# Altium schematic sheet Power.SchDoc: param:Title
size A4; Author: param:Autor; Wersja: param:Wersja
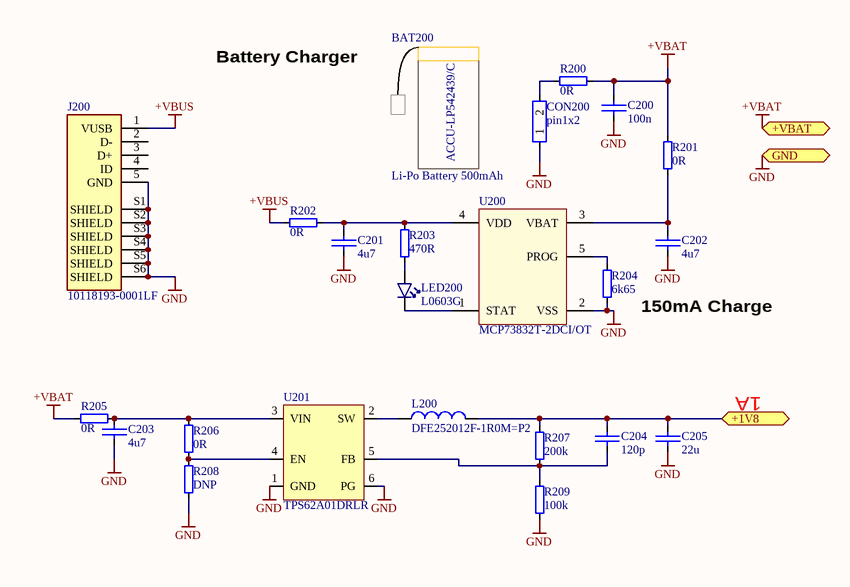
[diagram p0: Power.SchDoc]

## Parts
BAT200  Li-Po Battery 500mAh  [Battery 500maH]
C200  100n  [0402_C]
C201  4u7  [0603_C]
C202  4u7  [0603_C]
C203  4u7  [0603_C]
C204  120p  [0402_C]
C205  22u  [0805_c]
CON200  pin1x2  [piny1x2]
J200  10118193-0001LF  [FCI_10118193-0001LF]
L200  DFE252012F-1R0M=P2  [INDC2520X120N]
LED200  L0603G  [LED_0603_G]
R200  0R  [0603]
R201  0R  [0603]
R202  0R  [0603]
R203  470R  [0603]
R204  6k65  [0603]
R205  0R  [0603]
R206  0R  [0603]
R207  200k  [0603]
R208  DNP  [0603]
R209  100k  [0603]
U200  MCP73832T-2DCI/OT  [SOT95P280X145-5N]
U201  TPS62A01DRLR  [TPS62A01DRLR]

## Ports
+1V8 (bidir), +VBAT (bidir), GND (bidir)

## Nets
+VBAT: C200.2 R200.1 R201.1 R205.2 ; port +VBAT
+VBUS: J200.1(VUSB) R202.2
GND: C200.1 C201.1 C202.1 C203.1 C205.1 CON200.1 J200.5(GND) J200.S1(SHIELD) J200.S2(SHIELD) J200.S3(SHIELD) J200.S4(SHIELD) J200.S5(SHIELD) J200.S6(SHIELD) R204.2 R208.2 R209.2 U200.2(VSS) U201.1(GND) U201.6(PG) ; port GND
+1V8: C204.2 C205.2 L200.2 R207.1 ; port +1V8
NetC201_2: C201.2 R202.1 R203.1 U200.4(VDD)
NetC202_2: C202.2 R201.2 U200.3(VBAT)
NetC203_2: C203.2 R205.1 R206.1 U201.3(VIN)
NetC204_1: C204.1 R207.2 R209.1 U201.5(FB)
NetCON200_2: CON200.2 R200.2
NetL200_1: L200.1 U201.2(SW)
NetLED200_1: LED200.1(C) U200.1(STAT)
NetLED200_2: LED200.2(A) R203.2
NetR204_1: R204.1 U200.5(PROG)
NetR206_2: R206.2 R208.1 U201.4(EN)

Not connected (* = marked no-connect by the designer): J200 2(D-) 3(D+) 4(ID)

## Notes on the sheet
- Battery Charger
- ACCU-LP542439/C
- 150mA Charge
- 1A
- Project:
- Copyright
- ©
- AMC
- Designers:
- Subject:
- Variant:
- Data:
- Version:
- Sheet:
- /

## Library data of the parts
BAT200 = Li-Po Battery 500mAh: ACCU-LP542439/C
C200-C205 = CAP: Capacitor
CON200 = pin1x2: 1x2
J200 = 10118193-0001LF: USB - micro B USB 2.0 Receptacle Connector 5 Position Surface Mount, Right Angle; Through Hole; MF: Amphenol ICC; Availability: Unavailable; SnapEDA_Link: https://www.snapeda.com/parts/10118193-0001LF/Amphenol%20FCI/view-part/2758989/?ref=snap; MP: 10118193-0001LF; Price: None; Value: *; Package: None
L200 = DFE252012F-1R0M=P2: Inductor with Inductance: 1uH Tol. +/-20%, Package: 1008 _2520_; MF: Murata Electronics; MP: DFE252012F-1R0M=P2; Package: 2520 Murata; SnapEDA_Link: https://www.snapeda.com/parts/DFE252012F-1R0M%3DP2/Murata%20Electronics%20North%20America/view-part/1498728/?ref=snap; Digi-Key_Purchase_URL: https://www.digikey.ru/product-detail/en/murata-electronics/DFE252012F-1R0M=P2/490-13053-1-ND/5812765?utm_source=snapeda&utm_medium=aggregator&utm_campaign=symbol; Value: *; Digi-Key_Part_Number: 490-13053-1-ND
LED200 = D:LED: LED, Green, 0603, 573nm, Vf=2.0V, 24mcd, - 40 to +85°C; Part Number: VS 25C7M5; Manufacturer: Victory Electronics; Artikkelnr Noca: N.A.; Manufacturer Part Number: VS 25C7M5; Datasheet: \\hizz\pro\app9717\Datasheet\optoelectronics\Victory Electronics\VS 25C7M5.pdf; Footprint Doc: 0603; LatestRevisionDate: 2017-08-21; Pin Count: 2; Publisher: Nordic Semiconductor; Published: 2017-08-21; Value: L0603G; Note: *; Supplier: EC Partner; Supplier part number: *; 2nd source Supplier: *; 2nd source part number: *; Artikkelnr Simpro: N.A.
R200-R209 = RES
  R200-R202 R205 R206: Value: 0R
  R203: Value: 470R
  R204: Value: 6k65
  R207: Value: 200k
  R208: Value: DNP
  R209: Value: 100k
U200 = MCP73832T-2DCI/OT: Charger IC Lithium Ion/Polymer SOT-23-5; MF: Microchip; SnapEDA_Link: https://www.snapeda.com/parts/MCP73832T-2DCI/OT/Microchip/view-part/45011/?ref=snap; Mouser-Purchase-URL: https://snapeda.com/shop?store=Mouser&id=45011; Availability: Warning; MP: MCP73832T-2DCI/OT; Package: SOT-23 Microchip; Value: *; Price: None